# EasyEDA Pro project smart-switch-v101.eprj, board main-board
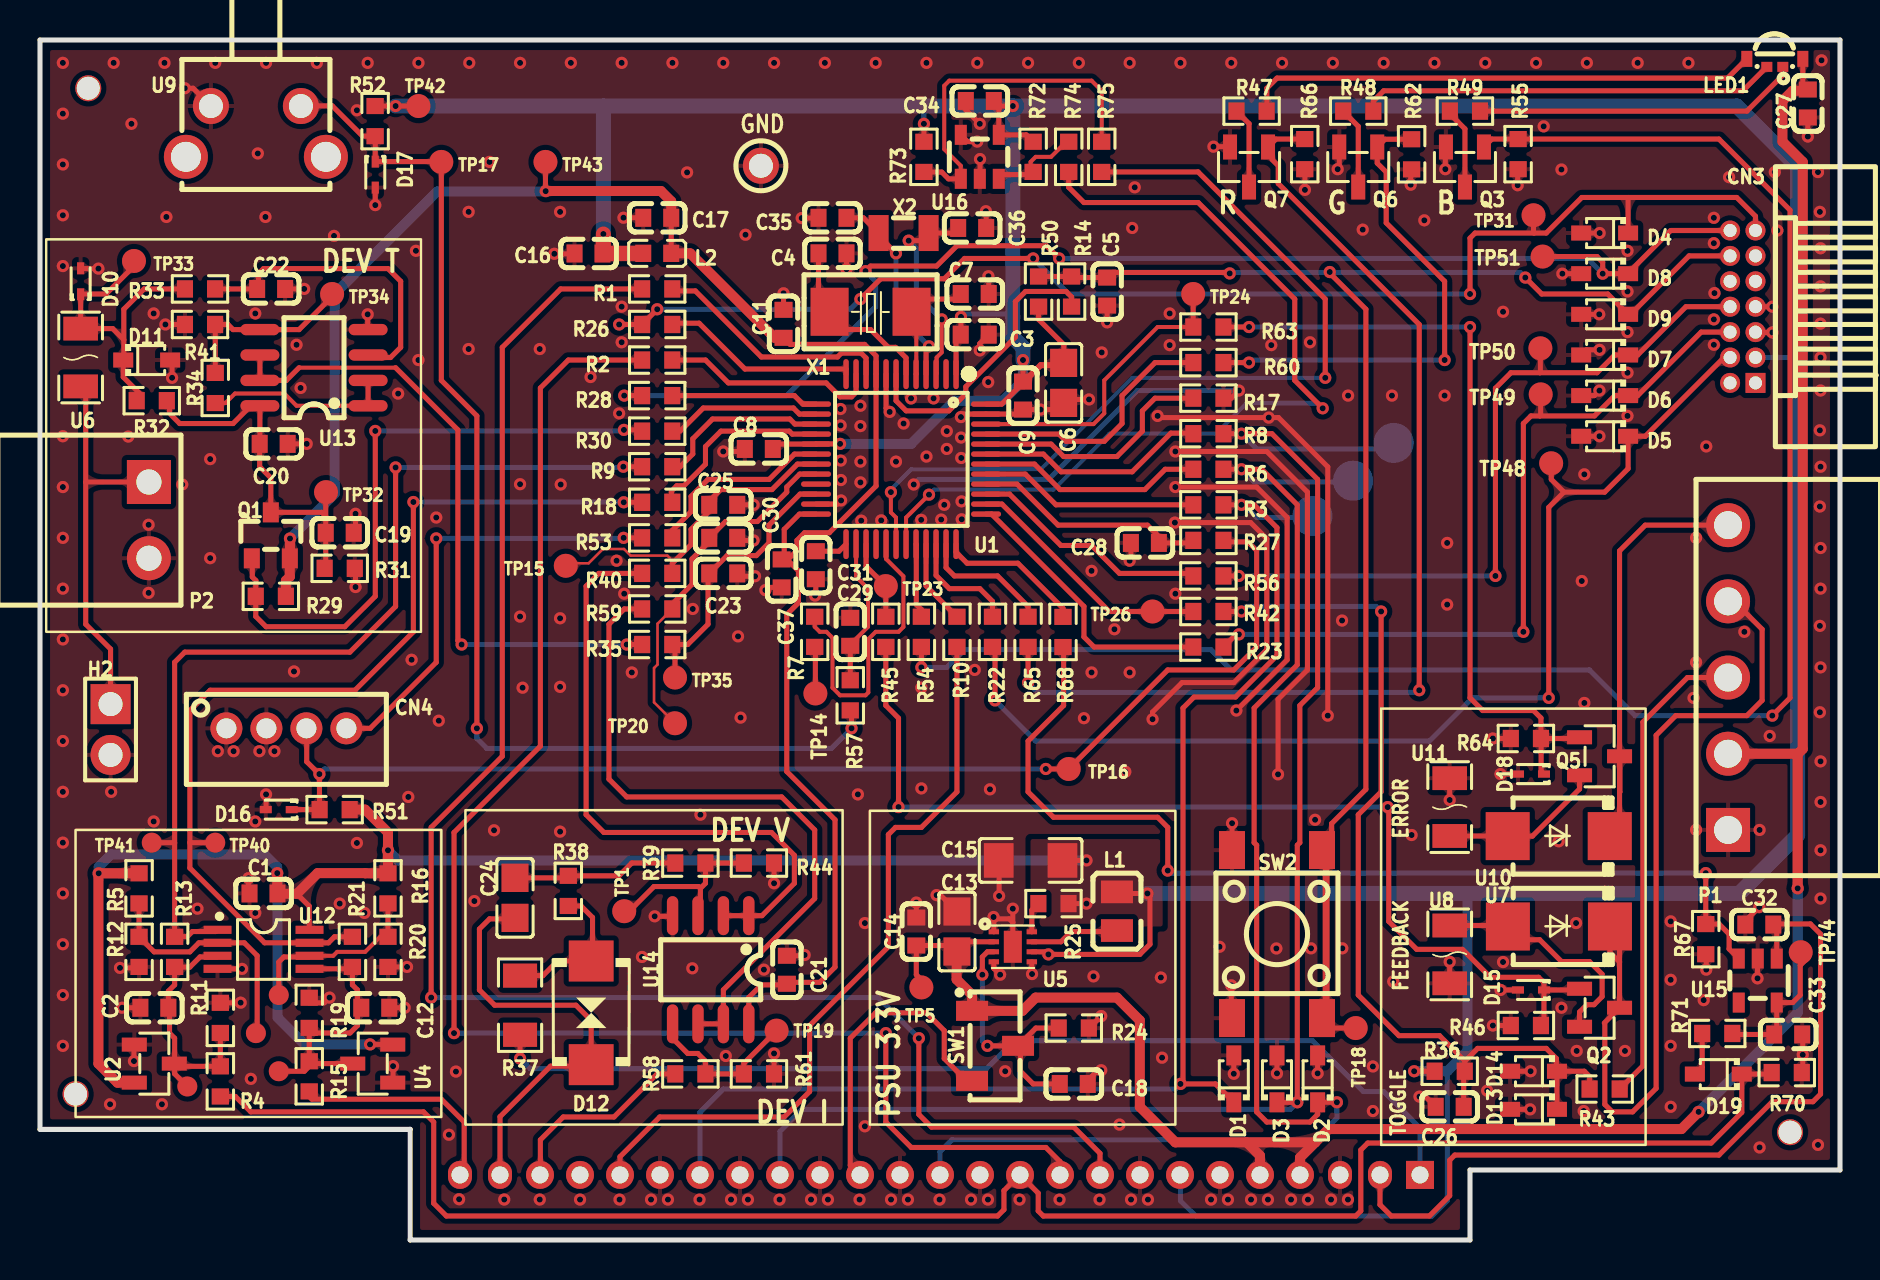
[diagram p3: board, top side]
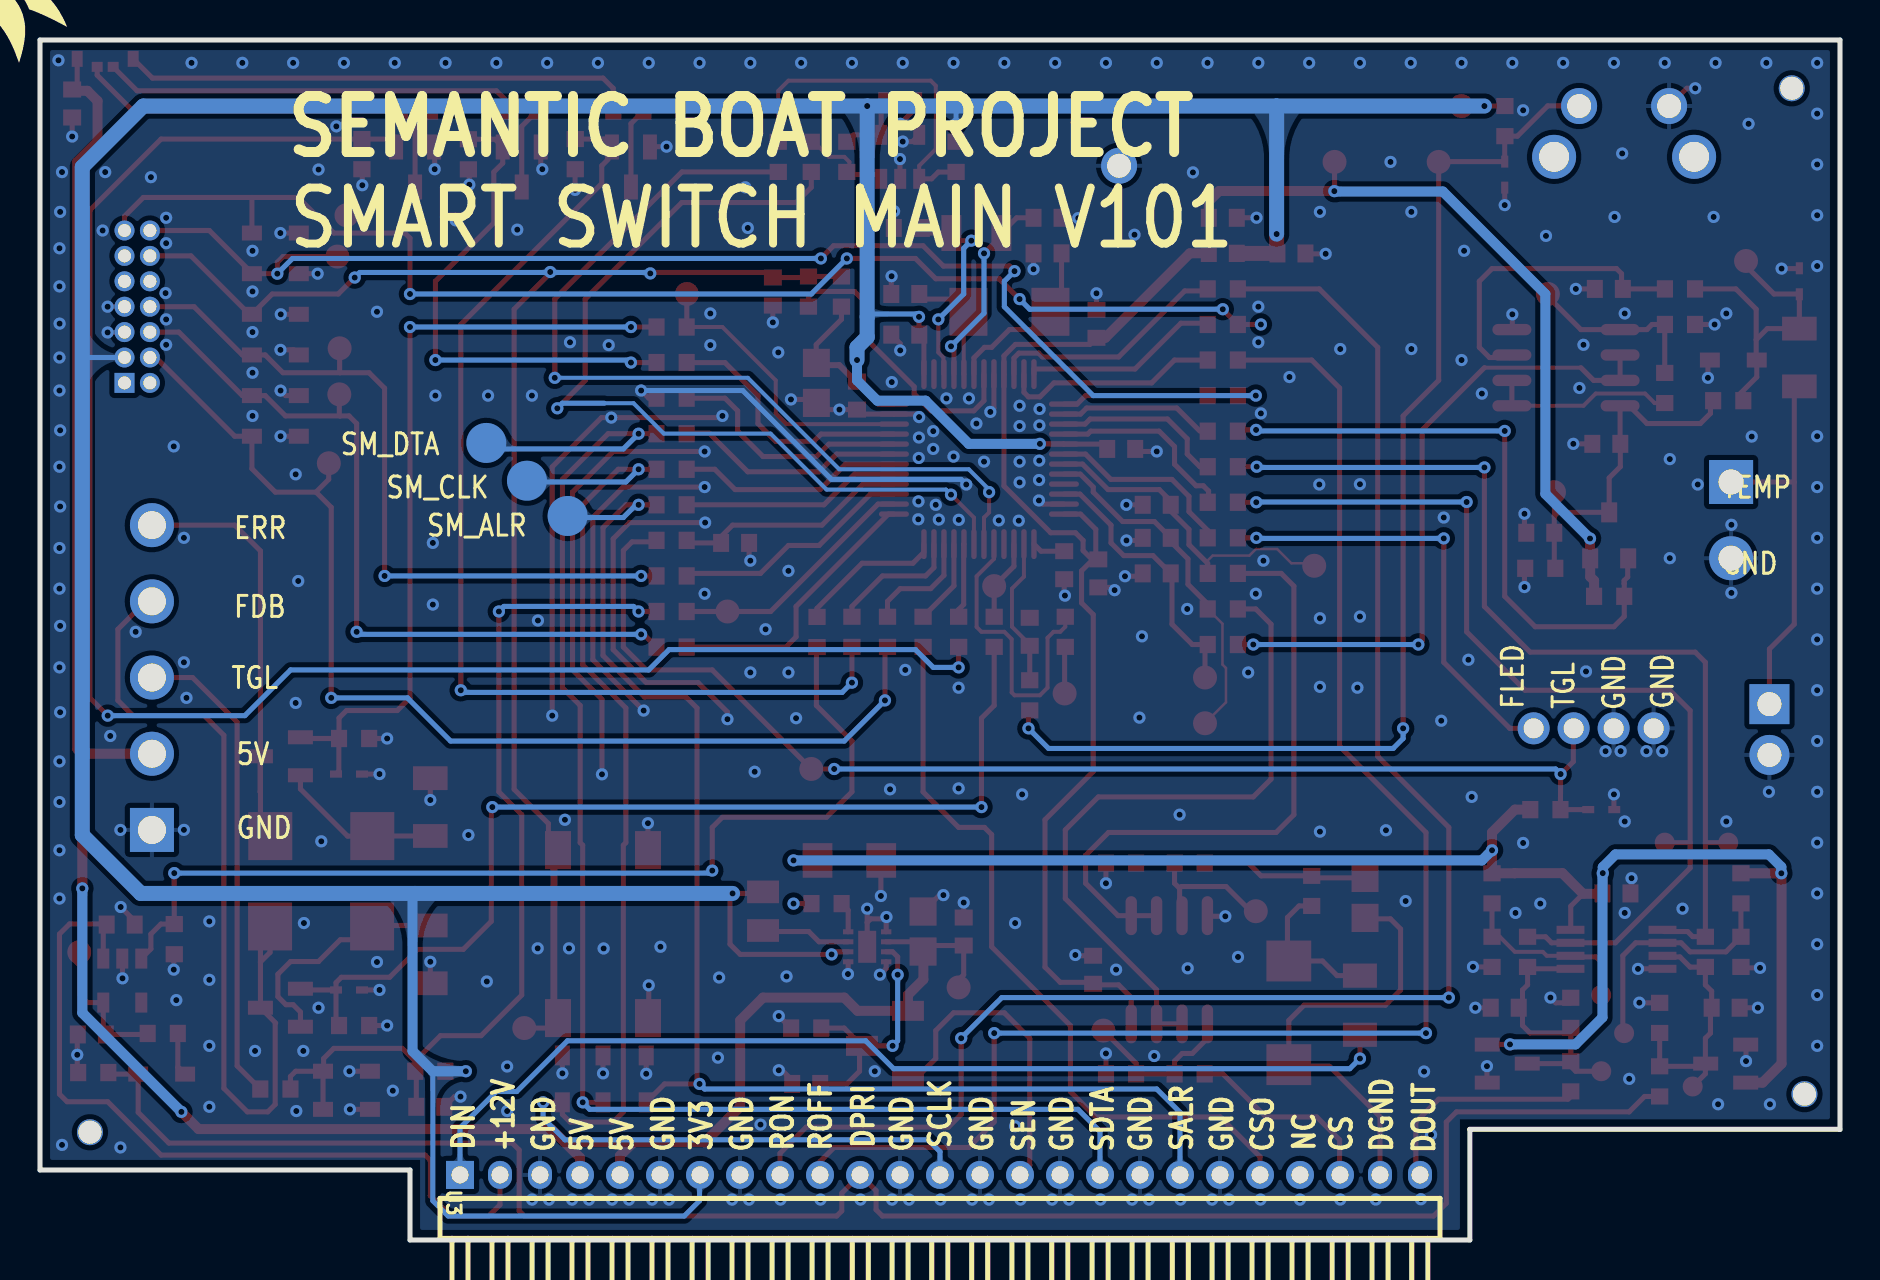
[diagram p4: board, bottom side, seen from below]

Outline 90 x 60 mm; copper layers: Top Layer, Inner1, Inner2, Bottom Layer. Coordinates in mm from the lower left corner of the outline.
Outline path: 0,60 90,60 90,3.5 71.5,3.5 71.5,0 18.51,0 18.51,5.53 0,5.53 0,60
Stack: Top Layer 0.035mm Outer layer thickness 1oz / Dielectric1 0.2104mm 7628 RC49% 8.6mil / Inner1 0.0152mm Inner layer thickness / Dielectric2 1.065mm 1.1mm H/HOZ Copper / Inner2 0.0152mm Inner layer thickness / Dielectric3 0.2104mm 7628 RC49% 8.6mil / Bottom Layer 0.035mm Outer layer thickness 1oz

## Design rules (mm)
template: JLCPCB Capability(Multiple Layers Board)
spacing copperThickness1oz (default): track to track 0.102, other pairs 0.152 to 0.3
spacing copperThickness2oz: track to track 0.203, other pairs 0.152 to 0.3
spacing copperThicknessInner0.5oz: track to track 0.089, other pairs 0.152 to 0.3
track width copperThickness1oz (default): min 0.102, default 0.254, max 2.54
track width copperThickness2oz: min 0.203, default 0.254, max 2.54
track width copperThickness0.5oz: min 0.089, default 0.254, max 2.54
differential pair differentialPair (default): width min 0.127, default 0.254, max 2.54; gap min 0.152, default 0.152
via viaSize (default): diameter min 0.3, default 0.61, max 10; hole min 0.2, default 0.305, max 6.3

## Placement (name value [footprint] x y rotation side)
C1  100nF  [C0603]  11.18 17.33 180 top
C2  2.2nF  [C0603]  5.72 11.61 0 top
C3  33pF  [C0603]  46.74 47.3 180 top
C4  33pF  [C0603]  39.62 49.33 180 top
C5  100nF  [C0603]  53.36 47.42 90 top
C6  4.7uF  [C0805]  51.18 42.86 90 top
C7  100nF  [C0603]  46.74 45.27 0 top
C8  100nF  [C0603]  35.94 39.55 180 top
C9  100nF  [C0603]  49.15 42.22 270 top
C11  100nF  [C0603]  37.18 45.81 90 top
C12  2.2nF  [C0603]  16.76 11.61 180 top
C13  10uF  [C0805]  45.85 15.42 90 top
C14  100nF  [C0603]  43.81 15.42 90 top
C15  22uF  [C1206]  49.53 18.98 180 top
C16  100nF  [C0603]  27.43 49.33 0 top
C17  100nF  [C0603]  30.86 51.11 0 top
C18  100nF  [C0603]  51.69 7.8 0 top
C19  100nF  [C0603]  14.99 35.36 0 top
C20  100nF  [C0603]  11.68 39.81 0 top
C21  100nF  [C0603]  37.34 13.51 90 top
C22  1nF  [C0603]  11.56 47.55 0 top
C23  100nF  [C0603]  34.16 33.33 0 top
C24  100nF  [C0805]  23.75 17.11 90 top
C25  22nF  [C0603]  34.16 36.76 180 top
C26  100nF  [C0603]  70.49 6.66 0 top
C27  100nF  [C0603]  88.39 56.83 270 top
C28  100nF  [C0603]  55.25 34.85 0 top
C29  100nF  [C0603]  40.51 30.41 270 top
C30  22nF  [C0603]  34.16 35.11 180 top
C31  100nF  [C0603]  38.79 33.74 90 top
C32  1uF  [C0603]  85.97 15.77 180 top
C33  10nF  [C0603]  87.41 10.28 180 top
C34  100nF  [C0603]  46.99 56.95 0 top
C35  22pF  [C0603]  39.62 51.11 0 top
C36  22pF  [C0603]  46.61 50.6 180 top
C37  100nF  [C0603]  37.08 33.33 270 top
CN3  HX PZ1.27-2x7P WZ  [HDR-TH_14P-P1.27-H-M-R2-C7-S1.27-W7.5-N]  85.14 46.67 90 top
CN4  B4B-PH-K-S(LF)(SN)  [CONN-TH_B4B-PH-K-S]  12.32 25.58 180 top
D1  PESD5V0U1UA,115  [SOD-323_L1.8-W1.3-LS2.5-RD]  59.69 8.06 90 top
D2  PESD5V0U1UA,115  [SOD-323_L1.8-W1.3-LS2.5-RD]  63.88 8.06 90 top
D3  PESD5V0U1UA,115  [SOD-323_L1.8-W1.3-LS2.5-RD]  61.85 8.06 90 top
D4  PESD5V0U1UA,115  [SOD-323_L1.8-W1.3-LS2.5-RD]  78.23 50.35 180 top
D5  PESD5V0U1UA,115  [SOD-323_L1.8-W1.3-LS2.5-RD]  78.23 40.19 180 top
D6  PESD5V0U1UA,115  [SOD-323_L1.8-W1.3-LS2.5-RD]  78.23 42.22 180 top
D7  PESD5V0U1UA,115  [SOD-323_L1.8-W1.3-LS2.5-RD]  78.23 44.25 180 top
D8  PESD5V0U1UA,115  [SOD-323_L1.8-W1.3-LS2.5-RD]  78.23 48.32 180 top
D9  PESD5V0U1UA,115  [SOD-323_L1.8-W1.3-LS2.5-RD]  78.23 46.28 180 top
D10  PESD3V3S1UB,115  [SOD-523_L1.2-W0.8-LS1.6-RD]  2.03 47.94 90 top
D11  BAT54WS-7-F  [SOD-323_L1.8-W1.3-LS2.5-RD]  5.33 44 0 top
D12  SMBJ28CA  [SMB_L4.6-W3.6-LS5.3-BI]  27.56 11.36 90 top
D13  PESD5V0U1UA,115  [SOD-323_L1.8-W1.3-LS2.5-RD]  74.68 6.53 180 top
D14  BAT54WS-7-F  [SOD-323_L1.8-W1.3-LS2.5-RD]  74.68 8.44 180 top
D15  PESD3V3S1UB,115  [SOD-523_L1.2-W0.8-LS1.6-RD]  74.55 12.5 180 top
D16  PESD3V3S1UB,115  [SOD-523_L1.2-W0.8-LS1.6-RD]  11.94 21.52 180 top
D17  PESD3V3S1UB,115  [SOD-523_L1.2-W0.8-LS1.6-RD]  16.76 53.27 270 top
D18  PESD3V3S1UB,115  [SOD-523_L1.2-W0.8-LS1.6-RD]  74.55 23.3 180 top
D19  1N5819WS  [SOD-323_L1.8-W1.3-LS2.5-RD]  83.92 8.29 180 top
H2  PZ254V-11-02P  [HDR-TH_2P-P2.54-V-M]  3.53 25.52 270 top
L1  2.2uH  [IND-SMD_L2.0-W1.6-1]  53.85 16.44 90 top
L2  BLM18KG601SN1D  [L0603]  30.86 49.33 0 top
LED1  MHS110RGBCT  [LED-ARRAY-SMD_MHS110RGBCT]  86.74 58.86 0 top
NOREF  -  [Pad_e184]  2.41 57.59 0 top
NOREF#2  -  [Pad_e3072]  87.5 5.39 0 top
NOREF#3  -  [Pad_e5111]  1.78 7.29 0 top
P1  WJ15EDGRC-3.81-5P  [CONN-TH_5P-P3.81_WJ15EDGRC-3.81-5P]  84.4 28.12 90 top
P2  WJ15EDGRC-3.81-2P  [CONN-TH_2P-P3.81_WJ15EDGRC-3.81-2P]  5.45 35.99 270 top
Q1  AO3401A  [SOT-23_L2.9-W1.3-P1.90-LS2.4-BR]  11.54 35.23 270 top
Q2  AO3400A  [SOT-23-3_L2.9-W1.3-P1.90-LS2.4-BR]  77.98 11.61 180 top
Q3  2N7002  [SOT-23-3_L2.9-W1.3-P1.90-LS2.4-BR]  71.25 53.65 90 top
Q5  AO3400A  [SOT-23-3_L2.9-W1.3-P1.90-LS2.4-BR]  77.98 24.19 180 top
Q6  2N7002  [SOT-23-3_L2.9-W1.3-P1.90-LS2.4-BR]  65.91 53.65 90 top
Q7  2N7002  [SOT-23-3_L2.9-W1.3-P1.90-LS2.4-BR]  60.45 53.65 90 top
R1  47Ω  [R0603]  30.86 47.55 0 top
R2  47Ω  [R0603]  30.86 44 0 top
R3  47Ω  [R0603]  58.42 36.76 180 top
R4  3.3MΩ  [R0603]  9.02 7.93 270 top
R5  1.8MΩ  [R0603]  4.95 17.58 90 top
R6  47Ω  [R0603]  58.42 38.54 180 top
R7  47Ω  [R0603]  38.74 30.41 90 top
R8  47Ω  [R0603]  58.42 40.31 180 top
R9  1kΩ  [R0603]  30.86 38.66 0 top
R10  47Ω  [R0603]  45.85 30.41 90 top
R11  430kΩ  [R0603]  9.02 11.1 270 top
R12  680kΩ  [R0603]  4.95 14.41 90 top
R13  10MΩ  [R0603]  6.73 14.41 270 top
R14  220Ω  [R0603]  51.58 47.42 270 top
R15  3.3MΩ  [R0603]  13.46 8.18 270 top
R16  1.8MΩ  [R0603]  17.4 17.58 90 top
R17  47kΩ  [R0603]  58.42 42.09 180 top
R18  1kΩ  [R0603]  30.86 36.89 0 top
R19  430kΩ  [R0603]  13.46 11.36 270 top
R20  680kΩ  [R0603]  17.4 14.41 90 top
R21  10MΩ  [R0603]  15.62 14.41 270 top
R22  47Ω  [R0603]  47.62 30.41 270 top
R23  47Ω  [R0603]  58.42 29.65 0 top
R24  100kΩ  [R0603]  51.69 10.6 0 top
R25  100kΩ  [R0603]  50.67 16.82 0 top
R26  100Ω  [R0603]  30.86 45.78 180 top
R27  100Ω  [R0603]  58.42 33.2 0 top
R28  100Ω  [R0603]  30.86 42.22 180 top
R29  100kΩ  [R0603]  11.54 32.18 0 top
R30  100Ω  [R0603]  30.86 40.44 180 top
R31  470kΩ  [R0603]  14.99 33.58 0 top
R32  10kΩ  [R0603]  5.59 41.97 0 top
R33  4.7kΩ  [R0603]  8 47.55 180 top
R34  220kΩ  [R0603]  8.76 42.6 270 top
R35  1kΩ  [R0603]  30.86 29.77 180 top
R36  100kΩ  [R0603]  70.49 8.44 180 top
R37  100Ω  [R1206]  24 11.74 90 top
R38  1kΩ  [R0603]  26.42 17.45 90 top
R39  270kΩ  [R0603]  32.52 18.85 0 top
R40  220Ω  [R0603]  30.86 33.33 180 top
R41  270kΩ  [R0603]  8 45.78 0 top
R42  4.7kΩ  [R0603]  58.42 31.42 180 top
R43  22kΩ  [R0603]  78.23 7.55 180 top
R44  30kΩ  [R0603]  35.95 18.85 180 top
R45  1kΩ  [R0603]  42.29 30.41 270 top
R46  100kΩ  [R0603]  74.29 10.72 180 top
R47  120Ω  [R0603]  60.58 56.44 0 top
R48  100Ω  [R0603]  65.91 56.44 0 top
R49  100Ω  [R0603]  71.25 56.44 0 top
R50  10kΩ  [R0603]  49.93 47.42 270 top
R51  10kΩ  [R0603]  14.73 21.52 0 top
R52  10kΩ  [R0603]  16.76 55.94 90 top
R53  820Ω  [R0603]  30.86 35.11 0 top
R54  100Ω  [R0603]  44.07 30.41 90 top
R55  100kΩ  [R0603]  73.91 54.29 270 top
R56  1kΩ  [R0603]  58.42 34.98 180 top
R57  1kΩ  [R0603]  40.51 27.23 90 top
R58  100kΩ  [R0603]  32.52 8.31 0 top
R59  220Ω  [R0603]  30.86 31.55 180 top
R60  100Ω  [R0603]  58.42 43.87 0 top
R61  56kΩ  [R0603]  35.95 8.31 180 top
R62  100kΩ  [R0603]  68.58 54.28 270 top
R63  1kΩ  [R0603]  58.42 45.65 0 top
R64  100kΩ  [R0603]  74.29 25.08 180 top
R65  100Ω  [R0603]  49.4 30.41 270 top
R66  100kΩ  [R0603]  63.24 54.29 270 top
R67  100kΩ  [R0603]  83.29 15.04 90 top
R68  47Ω  [R0603]  51.15 30.4 270 top
R70  470kΩ  [R0603]  87.34 8.37 180 top
R71  100kΩ  [R0603]  83.86 10.33 0 top
R72  3.3kΩ  [R0603]  49.66 54.16 90 top
R73  3.3kΩ  [R0603]  44.2 54.16 90 top
R74  47Ω  [R0603]  51.44 54.16 270 top
R75  47Ω  [R0603]  53.09 54.16 270 top
SW1  CAS-120A  [SW-SMD_CAS-120A]  47.75 9.71 270 top
SW2  TS-1002S-05026C  [KEY-SMD_4P-L6.0-W6.0-P4.50-LS9.0]  61.85 15.3 270 top
TP1  -  [Test-Point-0.5mm]  29.21 16.44 0 top
TP5  -  [Test-Point-0.5mm]  44.07 12.63 0 top
TP8  RH-5004  [TESTPOINT_TH_BD2.5-D1.2]  36.05 53.71 0 top
TP14  -  [Test-Point-0.5mm]  38.77 27.33 90 top
TP15  -  [Test-Point-0.5mm]  26.29 33.71 0 top
TP16  -  [Test-Point-0.5mm]  51.44 23.55 0 top
TP17  -  [Test-Point-0.5mm]  20.07 53.9 0 top
TP18  -  [Test-Point-0.5mm]  65.79 10.6 0 top
TP19  -  [Test-Point-0.5mm]  36.83 10.47 0 top
TP20  -  [Test-Point-0.5mm]  31.75 25.84 0 top
TP23  -  [Test-Point-0.5mm]  42.29 32.69 0 top
TP24  -  [Test-Point-0.5mm]  57.66 47.3 0 top
TP26  -  [Test-Point-0.5mm]  55.63 31.42 0 top
TP31  -  [Test-Point-0.5mm]  74.68 51.24 0 top
TP32  -  [Test-Point-0.5mm]  14.3 37.39 0 top
TP33  -  [Test-Point-0.5mm]  4.7 48.95 0 top
TP34  -  [Test-Point-0.5mm]  14.61 47.3 0 top
TP35  -  [Test-Point-0.5mm]  31.75 28.12 0 top
TP36  -  [Test-Point-0.5mm#2]  7.37 7.68 0 top
TP37  -  [Test-Point-0.5mm#2]  10.8 10.34 0 top
TP38  -  [Test-Point-0.5mm#2]  11.94 8.44 0 top
TP39  -  [Test-Point-0.5mm#2]  11.94 12.25 0 top
TP40  -  [Test-Point-0.5mm#2]  8.76 19.87 0 top
TP41  -  [Test-Point-0.5mm#2]  5.59 19.87 0 top
TP42  -  [Test-Point-0.5mm]  18.92 56.7 0 top
TP43  -  [Test-Point-0.5mm]  25.27 53.9 0 top
TP44  -  [Test-Point-0.5mm]  88.04 14.39 0 top
TP45  -  [Test-Point-0.5mm#3]  67.68 39.85 180 bottom
TP46  -  [Test-Point-0.5mm#3]  65.65 37.96 180 bottom
TP47  -  [Test-Point-0.5mm#3]  63.62 36.2 180 bottom
TP48  -  [Test-Point-0.5mm]  75.56 38.84 0 top
TP49  -  [Test-Point-0.5mm]  75.03 42.28 0 top
TP50  -  [Test-Point-0.5mm]  75.02 44.58 0 top
TP51  -  [Test-Point-0.5mm]  75.13 49.17 0 top
U1  STM32F373CCT6  [LQFP-48_L7.0-W7.0-P0.50-LS9.0-BL]  43.05 39.05 180 top
U2  BAV199  [SOT-23-3_L2.9-W1.3-P0.95-LS2.4-BR]  5.72 8.82 180 top
U3  KH-2PH90-1X25P-L10.5  [HDR-TH_25P-P2.00-H-M-W7.5-N]  45 3.25 180 bottom
U4  BAV199  [SOT-23-3_L2.9-W1.3-P0.95-LS2.4-BR]  16.64 8.82 0 top
U5  TPS62162DSGR  [WSON-8_L2.0-W2.0-P0.50-TL-EP]  48.64 14.66 0 top
U6  JK-nSMD005/60V  [F1206]  2.03 44.12 90 top
U7  SMBJ18A  [SMB_L4.5-W3.6-LS5.4-RD]  75.95 15.68 180 top
U8  JK-nSMD005/60V  [F1206]  70.49 14.28 90 top
U9  TC-6615-9.0-160G  [KEY-TH_PTS645VXX83XLFS]  10.8 55.43 180 top
U10  SMBJ18A  [SMB_L4.5-W3.6-LS5.4-RD]  75.94 20.19 180 top
U11  JK-nSMD005/60V  [F1206]  70.49 21.65 270 top
U12  RS8905XM  [MSOP-8_L3.0-W3.0-P0.65-LS4.9-BL]  11.18 14.53 270 top
U13  TLV9062IDR  [SOIC-8_L5.0-W4.0-P1.27-LS6.0-BL]  13.7 43.61 90 top
U14  TLV9062IDR  [SOIC-8_L5.0-W4.0-P1.27-LS6.0-BL]  33.53 13.51 180 top
U15  TMI6240  [SOT-23-5_L2.9-W1.6-P0.95-LS2.8-BL]  85.89 12.97 180 top
U16  AD24C02  [SOT-23-5_L2.9-W1.6-P0.95-LS2.8-BL]  46.99 54.16 0 top
X1  8MHz  [CRYSTAL-SMD_L5.0-W3.2]  41.53 46.41 0 top
X2  32.768kHz  [FC-135R_L3.2-W1.5]  43.18 50.35 0 top

## Footprints (pads in the part's own frame, mm; a bottom-side part is the same pattern mirrored in y, then rotated)
C0603
  rect 0.8x0.9 smd: 1(-0.7,0) 2(0.7,0)
C0805
  rect 1.41x1.35 smd: 1(-1,0) 2(1,0)
C1206
  rect 1.485x1.728 smd: 1(-1.593,0) 2(1.593,0)
CONN-TH_2P-P3.81_WJ15EDGRC-3.81-2P
  rect 2.2x2.2 hole 1.26: 1(-1.905,0)
  round 2.2 hole 1.26: 2(1.905,0)
CONN-TH_5P-P3.81_WJ15EDGRC-3.81-5P
  rect 2.2x2.2 hole 1.4: 1(-7.62,0)
  round 2.2 hole 1.4: 2(-3.81,0) 3(0,0) 4(3.81,0) 5(7.62,0)
CONN-TH_B4B-PH-K-S
  round 1.6 hole 1: 1(3,0) 2(1,0) 3(-1,0) 4(-3,0)
CRYSTAL-SMD_L5.0-W3.2
  rect 1.9x2.4 smd: 1(-2.05,0) 2(2.05,0)
F1206
  rect 1.19x1.728 smd: 1(-1.445,0) 2(1.445,0)
FC-135R_L3.2-W1.5
  rect 1x1.8 smd: 1(-1.25,0) 2(1.25,0)
HDR-TH_2P-P2.54-V-M
  rect 2x2 hole 1.2: 1(-1.27,0)
  round 2 hole 1.2: 2(1.27,0)
HDR-TH_14P-P1.27-H-M-R2-C7-S1.27-W7.5-N
  rect 1x1 hole 0.65: 1(-3.81,-0.635)
  round 1 hole 0.65: 2(-3.81,0.635) 3(-2.54,-0.635) 4(-2.54,0.635) 5(-1.27,-0.635) 6(-1.27,0.635) 7(0,-0.635) 8(0,0.635) 9(1.27,-0.635) 10(1.27,0.635) 11(2.54,-0.635) 12(2.54,0.635) 13(3.81,-0.635) 14(3.81,0.635)
HDR-TH_25P-P2.00-H-M-W7.5-N
  rect 1.4x1.4 hole 0.85: 1(-24,0)
  oval 1.2x1.4 hole 0.85: 2(-22,0) 3(-20,0) 24(22,0) 25(24,0)
  round 1.4 hole 0.85: 4(-18,0) 5(-16,0) 6(-14,0) 7(-12,0) 8(-10,0) 9(-8,0) 10(-6,0) 11(-4,0) 12(-2,0) 13(0,0) 14(2,0) 15(4,0) 16(6,0) 17(8,0) 18(10,0) 19(12,0) 20(14,0) 21(16,0) 22(18,0) 23(20,0)
IND-SMD_L2.0-W1.6-1
  rect 1.133x1.6 smd: 1(-0.967,0) 2(0.967,0)
KEY-SMD_4P-L6.0-W6.0-P4.50-LS9.0
  rect 1.9x1.3 smd: 1(-4.2,2.25) 2(4.2,2.25) 3(-4.2,-2.25) 4(4.2,-2.25)
KEY-TH_PTS645VXX83XLFS
  round 1.8 hole 1.2: 1(-2.25,-1.27) 2(2.25,-1.27)
  round 2.2 hole 1.5: 3(-3.5,1.27) 4(3.5,1.27)
L0603
  rect 0.8x0.864 smd: 1(-0.7,0) 2(0.7,0)
LED-ARRAY-SMD_MHS110RGBCT
  rect 0.55x0.5 smd: 1(0.4,-0.2) 4(-0.4,-0.2)
  rect 0.55x0.8 smd: 2(1.4,0.2) 3(-1.4,0.2)
LQFP-48_L7.0-W7.0-P0.50-LS9.0-BL
  oval 0.27x1.5 smd: 1(-2.75,-4.25) 2(-2.25,-4.25) 3(-1.75,-4.25) 4(-1.25,-4.25) 5(-0.75,-4.25) 6(-0.25,-4.25) 7(0.25,-4.25) 8(0.75,-4.25) 9(1.25,-4.25) 10(1.75,-4.25) 11(2.25,-4.25) 12(2.75,-4.25) 25(2.75,4.25) 26(2.25,4.25) 27(1.75,4.25) 28(1.25,4.25) 29(0.75,4.25) 30(0.25,4.25) 31(-0.25,4.25) 32(-0.75,4.25) 33(-1.25,4.25) 34(-1.75,4.25) 35(-2.25,4.25) 36(-2.75,4.25)
  oval 1.5x0.27 smd: 13(4.25,-2.75) 14(4.25,-2.25) 15(4.25,-1.75) 16(4.25,-1.25) 17(4.25,-0.75) 18(4.25,-0.25) 19(4.25,0.25) 20(4.25,0.75) 21(4.25,1.25) 22(4.25,1.75) 23(4.25,2.25) 24(4.25,2.75) 37(-4.25,2.75) 38(-4.25,2.25) 39(-4.25,1.75) 40(-4.25,1.25) 41(-4.25,0.75) 42(-4.25,0.25) 43(-4.25,-0.25) 44(-4.25,-0.75) 45(-4.25,-1.25) 46(-4.25,-1.75) 47(-4.25,-2.25) 48(-4.25,-2.75)
MSOP-8_L3.0-W3.0-P0.65-LS4.9-BL
  rect 0.406x1.397 smd: 1(-0.975,-2.3) 2(-0.325,-2.3) 3(0.325,-2.3) 4(0.975,-2.3) 5(0.975,2.3) 6(0.325,2.3) 7(-0.325,2.3) 8(-0.975,2.3)
Pad_e184
  round 1.3 hole 1.152: 1(0,0)
Pad_e3072
  round 1.3 hole 1.152: 1(0,0)
Pad_e5111
  round 1.3 hole 1.152: 1(0,0)
R0603
  rect 0.806x0.864 smd: 1(-0.753,0) 2(0.753,0)
R1206
  rect 1.208x1.701 smd: 1(-1.479,0) 2(1.479,0)
SMB_L4.5-W3.6-LS5.4-RD
  rect 2.2x2.4 smd: 1(-2.551,0) 2(2.551,0)
SMB_L4.6-W3.6-LS5.3-BI
  rect 2.047x2.241 smd: 1(-2.591,0) 2(2.591,0)
SOD-323_L1.8-W1.3-LS2.5-RD
  rect 1x0.75 smd: 1(-1.173,0) 2(1.173,0)
SOD-523_L1.2-W0.8-LS1.6-RD
  rect 0.6x0.36 smd: 1(-0.65,0) 2(0.65,0)
SOIC-8_L5.0-W4.0-P1.27-LS6.0-BL
  oval 0.569x1.95 smd: 1(-1.905,-2.705) 2(-0.635,-2.705) 3(0.635,-2.705) 4(1.905,-2.705) 5(1.905,2.705) 6(0.635,2.705) 7(-0.635,2.705) 8(-1.905,2.705)
SOT-23-3_L2.9-W1.3-P0.95-LS2.4-BR
  rect 1.25x0.7 smd: 1(1,-0.95) 2(1,0.95) 3(-1,0)
SOT-23-3_L2.9-W1.3-P1.90-LS2.4-BR
  rect 1.25x0.7 smd: 1(1,-0.95) 2(1,0.95) 3(-1,0)
SOT-23-5_L2.9-W1.6-P0.95-LS2.8-BL
  rect 0.6x1 smd: 1(-0.95,-1.1) 2(0,-1.1) 3(0.95,-1.1) 4(0.95,1.1) 5(-0.95,1.1)
SOT-23_L2.9-W1.3-P1.90-LS2.4-BR
  rect 1x0.8 smd: 1(1.15,-0.95) 2(1.15,0.95) 3(-1.15,0)
SW-SMD_CAS-120A
  rect 1x1.6 smd: 1(-1.75,-1.15) 2(0,1.15) 3(1.75,-1.15)
Test-Point-0.5mm
  round 1.2 smd: 1(0,0)
Test-Point-0.5mm#2
  round 1 smd: 1(0,0)
Test-Point-0.5mm#3
  round 2 smd: 1(0,0)
TESTPOINT_TH_BD2.5-D1.2
  round 1.8 hole 1.2: 1(0,0)
WSON-8_L2.0-W2.0-P0.50-TL-EP
  rect 0.521x0.25 smd: 1(-0.95,0.75) 2(-0.95,0.25) 3(-0.95,-0.25) 4(-0.95,-0.75) 5(0.95,-0.75) 6(0.95,-0.25) 7(0.95,0.25) 8(0.95,0.75)
  rect 0.9x1.6 smd: 9(0,0)

## Nets
As in the schematic.

Pads without a net: CN3 1 2 9 10 11; NOREF 1; NOREF#2 1; NOREF#3 1; U1 2 21 28; U3 22; U9 3 4; U15 4

## Via types
v1: diameter 0.61, hole 0.305, Top Layer to Bottom Layer, 473 vias

## Routing (per net, layer and track width the routed paths; a pad name or vN(x,y) marks a point on that pad's centre or on a via; arc(x,y) is an arc through that point)
+3V3: length 332
  Top Layer w0.254: 49.15,42.86 48.09,41.8 U1.48 ; 36.9,39.81 36.91,39.8 U1.17 38.81,39.81 v1(40,39.81) ; R50.2 49.93,46.03 51.19,44.77 51.19,43.86 ; 47.94,56.7 U16.4 49.31,55.26 R72.2 ; 47.94,56.7 47.94,56.7 v1(48.64,56.7) ; 47.94,56.7 C34.2 ; v1(46.05,46.16) 46.05,45.28 C7.1 ; U4.2 17.63,9.78 v1(16.5,9.78) ; R52.2 v1(17.78,56.7) TP42.1 ; 49.59,14.41 50.29,14.41 v1(50.42,14.28) 54.99,14.28 55.5,14.79 55.5,17.2 v1(55.37,17.33) 53.93,17.33 L1.2 ; 12.85,17.31 13.46,16.69 13.46,15.52 U12.8 ; U1.1 45.8,45.03 ; C9.1 v1(49.15,44) ; C15.1 v1(52.32,18.98) ; v1(52.32,16.82) 51.43,16.82 ; R73.2 v1(44.2,55.81) ; v1(68.71,8.44) R36.2
  Top Layer w0.3: 49.21,42.92 50.04,43.74 51.07,43.74 C6.2
  Top Layer w0.5: v1(11.86,18.34) 11.86,17.38 11.81,17.33 ; v1(2.93,18.34) 2.92,18.32 2.92,8.82 3.87,7.87 4.71,7.87 U2.2 ; R51.2 16.26,21.52 17.4,20.38 v1(17.4,19.49) R16.2 16.26,18.34 16.26,18.34 13.88,18.34 12.85,17.31 12.11,17.31
  Top Layer w0.508: v1(2.93,18.34) R5.2
  Top Layer w0.75: L2.1 30.16,49.33 C16.2 28.17,49.37 v1(28.17,50.3)
  Bottom Layer w0.25: 70.36,8.43 70.36,1.96 69.6,1.2 57.78,1.2 57.02,1.96 57.02,3.23 U3.7
  Bottom Layer w0.254: v1(46.05,46.16) 46.19,46.3 48.5,46.3 48.64,46.16 ; 85.78,44.12 87.76,44.12 ; v1(44.2,55.81) 44.2,56.69 44.19,56.7
  Bottom Layer w0.5: v1(52.32,18.98) 17.91,18.98 v1(17.4,19.49) ; 71.25,17.33 71.37,17.2 71.37,9.45 70.37,8.44 ; v1(40,39.81) 43.56,39.81 45.72,41.97 48.13,41.97 49.15,42.98 v1(49.15,44) ; v1(2.93,18.34) 2.93,18.66 3.56,19.28 11.23,19.28 11.86,18.64 v1(11.86,18.34) 11.88,18.33 11.88,11.13 13.22,9.78 v1(16.5,9.78)
  Bottom Layer w0.508: 70.37,8.44 v1(68.71,8.44)
  Bottom Layer w0.75: v1(55.37,17.33) 84.96,17.33 87.88,20.25 87.88,53.65 84.84,56.7 v1(48.64,56.7) ; 28.18,56.7 28.17,56.69 v1(28.17,50.3) ; 28.18,56.7 v1(17.78,56.7) ; 28.18,56.7 v1(48.64,56.7) ; v1(48.64,56.7) 48.64,45.14 49.15,44.63 v1(49.15,44)
+5V: length 115.9
  Top Layer w0.254: TP5.1 44.07,13.01 43.81,13.26 C14.1 45.55,14.72 C13.1 46.34,14.91 U5.2 ; C27.1 88.14,57.78 88.14,59.06
  Top Layer w0.5: 60.33,4.88 61,4.22 U3.5 ; 60.33,4.88 56.77,4.88 54.99,6.66 54.99,10.98 53.85,12.12 49.78,12.12 49.12,11.46 SW1.1 46.6,12.25 45.83,13.03 45.83,14.41 C13.1 ; 60.33,4.88 63.76,4.88 ; 63.76,4.88 63,4.12 U3.4 ; 63.76,4.88 64.43,5.55 82.07,5.55 v1(82.93,6.41) ; 88.29,57.46 87.63,57.46 87.12,56.95 87.12,54.92 88.14,53.9 88.14,24.55 87.88,24.3
  Top Layer w0.508: v1(87.88,17.58) 87.88,24.3 87.87,24.31 P1.2
  Bottom Layer w0.508: v1(87.88,17.58) 87.88,11.36 v1(82.93,6.41)
+12V: length 39.7
  Top Layer w0.254: U15.1 86.84,15.6 C32.1 86.7,15.8 88.52,15.8 89.03,15.3 89.03,7.29 88.65,6.91 86.61,6.91 83.95,4.25 70.74,4.25 70.49,3.99 70.49,2.22 69.47,1.2 67.56,1.2 67,1.76 U3.2
GND: length 194.6
  Top Layer w0.254: U13.4 16.38,45.54 v1(16.38,46.28) ; 13.46,11.86 14.22,11.86 v1(14.48,12.12) ; R44.1 36.7,18.84 v1(36.7,17.84) ; v1(42.48,41.41) 42.3,41.59 U1.8 ; R31.2 15.78,33.55 v1(15.78,32.65) ; v1(59.82,26.47) 62.36,29.01 62.36,36.12 60.83,37.65 v1(56.77,37.65) ; C36.1 47.31,51.43 v1(47.29,51.44) ; 69.78,6.66 69.28,7.17 v1(68.97,7.17) ; U15.2 85.88,14.06 v1(85.88,13.08) ; v1(85.97,16.65) 85.27,15.95 C32.2 ; C4.1 v1(40.32,48.54) ; v1(53.06,8.49) 52.89,8.49 52.43,8.02 52.64,7.8 ; v1(61.85,8.33) D3.2 ; 34.86,34.98 34.87,34.98 v1(35.68,34.98) ; v1(38.75,32.22) 38.79,32.26 C31.1 ; 54.54,34.85 54.54,34.03 v1(54.48,33.97) ; v1(70.27,53.54) 70.27,54.62 70.3,54.65 ; v1(16.76,51.75) D17.2 ; R61.1 36.7,8.31 v1(36.7,9.33) ; C3.1 47.44,48.17 v1(47.42,48.19) ; v1(77.98,50.35) D4.2 ; v1(59.94,42.47) 59.56,42.09 R17.1 ; v1(30.73,16.19) 31.6,16.19 U14.4 ; v1(56.74,35.87) 60.53,35.87 61.34,35.06 61.34,29.52 59.69,27.87 57.1,27.87 55.63,26.4 v1(55.63,26.04) ; 17.34,11.61 v1(18.23,11.61) ; v1(77.97,42.47) 77.72,42.22 D6.2 ; v1(83.31,13.52) 83.31,14.26 83.29,14.29 ; C20.2 v1(13.33,39.81) ; 47.69,16.01 47.74,16.06 48.46,16.06 48.64,15.88 ; 47.69,16.01 47.69,16.14 v1(47.68,16.15) ; 47.69,16.01 U5.1 ; Q7.2 59.49,54.67 v1(58.67,54.67) ; v1(48.01,13.26) 47.69,13.58 U5.4 ; v1(68.53,52.76) 68.53,53.49 R62.2 ; R20.1 18.35,13.65 v1(18.35,13.66) ; D11.2 6.6,43.9 v1(6.6,43.11) ; v1(86.62,45.38) 85.79,45.38 85.78,45.39 ; v1(15.78,36.31) 15.78,35.45 C19.2 ; v1(49.6,13.3) 49.59,13.31 49.59,13.91 ; v1(59.6,20.84) 59.6,19.63 59.6,19.62 ; U9.2 7.66,57.59 v1(7.24,57.59) ; v1(10.42,18.09) 10.42,17.25 10.48,17.2 ; v1(61.9,23.28) 61.9,27.03 63.37,28.5 63.37,37.39 61.34,39.43 v1(56.77,39.43) ; v1(4,13.61) 4.91,13.61 R12.1 ; R41.1 v1(6.27,45.78) ; v1(88.39,55.17) 88.39,55.87 88.65,56.12 ; 34.86,33.2 34.88,33.19 v1(35.75,33.19) ; C21.2 38.19,14.21 v1(38.23,14.25) ; C17.1 29.82,51.11 29.82,51.11 v1(29.18,51.11) ; v1(4.7,8.95) 4.7,9.75 U2.1 ; v1(63.88,8.33) D2.2 ; v1(11.3,22.28) 11.3,21.53 D16.2 ; v1(43.81,16.87) C14.2 ; v1(76.12,48.32) D8.2 ; C13.2 45.03,17.25 v1(44.83,17.25) ; v1(34.16,39.43) 35.11,39.43 C8.2 35.5,39.81 ; v1(47.96,17.2) 47.96,18.96 C15.2 ; v1(63.25,52.51) 63.25,53.53 R66.2 ; v1(52.45,42.03) 51.35,42.03 C6.1 50.85,41.52 v1(50.03,41.52) C9.2 48.92,41.3 U1.47 46.2,41.3 v1(46.05,41.15) ; v1(72.64,25.08) R64.2 ; 48.64,15.88 v1(48.64,16.57) ; 48.64,15.88 U5.9 ; v1(10.03,11.87) 10.02,11.86 R11.1 ; v1(10.1,13.56) 10.1,13.56 U12.4 ; 26.74,49.31 25.72,49.31 v1(25.72,49.31) ; v1(73.03,23.3) D18.2 ; v1(86.62,46.67) 85.78,46.67 ; v1(46.99,44.48) 46.99,44.82 C7.2 ; v1(47,54.05) 47,53.07 U16.2 ; v1(73.03,12.5) D15.2 ; v1(46.99,55.81) 46.29,56.51 C34.1 ; U4.1 17.65,7.88 v1(17.65,8.69) ; Q6.2 64.96,53.62 v1(64.88,53.54) ; v1(72.64,10.72) R46.2 ; 2.03,48.58 2.05,48.57 v1(2.92,48.57) ; 59.6,11.22 59.56,11.26 v1(59.56,12.73) ; 52.7,10.6 52.7,10.83 v1(53.06,11.2) ; v1(55.88,41.2) 55.96,41.12 v1(61.44,41.12) 61.93,41.12 64.39,38.66 v1(64.39,26.22) ; C35.1 38.91,51.1 v1(38.09,51.1) ; v1(77.98,44.51) 77.31,44.51 D7.2 ; v1(13.21,47.55) C22.2 ; C5.1 v1(53.36,45.88) ; v1(70.49,13.91) U8.1 ; v1(77.96,46.28) D9.2 ; v1(74.53,8.44) D14.2 ; v1(77.97,40.19) D5.2 ; C37.2 36.41,32.63 v1(36.27,32.49) ; C33.1 88.14,10.25 v1(88.14,9.26) 88.14,8.42 R70.1 ; R55.2 73.88,53.52 v1(73.88,52.74) ; U16.5 46.38,54.92 v1(46.86,54.92) ; C2.1 v1(4.11,11.61) ; v1(59.69,8.31) D1.2 ; U1.23 39.87,36.8 v1(40.05,36.98) ; C25.1 v1(35.68,36.76) ; v1(37.18,47.33) C11.2 ; v1(70.49,22) U11.1 ; v1(74.5,6.53) D13.2
  Bottom Layer w0.254: v1(43.69,37.78) 43.94,38.03 50.42,38.03 54.86,42.47 v1(59.94,42.47)
  vias: v1(1.14,58.86) v1(1.14,56.32) v1(1.14,53.78) v1(1.14,51.24) v1(1.14,48.7) v1(1.14,40.19) v1(1.14,37.65) v1(1.14,35.11) v1(1.14,32.57) v1(1.14,30.03) v1(1.14,27.49) v1(1.14,24.95) v1(1.14,22.41) v1(1.14,19.87) v1(1.14,17.33) v1(1.14,14.79) v1(1.14,12.25) v1(1.14,9.71) v1(3.5,6.79) v1(3.56,22.41) v1(3.68,58.86) v1(4.41,40.17) v1(4.57,55.81) v1(5.43,35.76) v1(5.43,32.36) v1(5.68,46.33) v1(5.68,20.93) v1(6.1,6.79) v1(6.22,58.86) v1(6.32,51.15) v1(7.11,37.78) v1(7.87,16.57) v1(8.51,39.05) v1(8.51,34.09) v1(8.76,58.86) v1(8.89,24.44) v1(9.68,24.44) v1(10.54,8.06) v1(10.76,46.33) v1(10.76,20.93) v1(10.76,16.35) v1(10.89,54.33) v1(10.97,24.44) v1(11.3,58.86) v1(11.27,51.15) v1(11.72,24.44) v1(12.7,28.43) v1(12.83,44.76) v1(13.03,42.6) v1(13.84,58.86) v1(14.7,50.2) v1(14.99,16.82) v1(15.84,56.49) v1(15.84,19.85) v1(16.22,16.35) v1(16.38,58.86) v1(17.91,42.32) v1(18.42,22.15) v1(18.58,29.01) v1(18.8,49.46) v1(18.92,58.86) v1(18.92,44) v1(19.81,36.12) v1(19.94,25.96) v1(20.45,5.26) v1(20.8,8.42) v1(20.95,2.04) v1(21.43,51.41) v1(21.43,44.55) v1(21.46,58.86) v1(21.72,16.95) v1(22.48,53.9) v1(22.7,20.49) v1(23.21,2.02) v1(24,58.86) v1(24,37.79) v1(24,31.17) v1(24.13,27.61) v1(24.99,44.55) v1(24.99,2.02) v1(26,51.41) v1(26.03,37.78) v1(26,31.09) v1(26,27.66) v1(26,20.42) v1(26.54,58.86) v1(27,2.02) v1(27.53,43.15) v1(28.83,33.97) v1(28.96,41.33) v1(28.98,2.02) v1(29.08,58.86) v1(29.08,46.67) v1(29.08,44.89) v1(29.21,32.31) v1(29.59,28.38) v1(30.1,14.15) v1(30.55,2.02) v1(31.4,2.02) v1(31.62,58.86) v1(32.35,53.38) v1(32.64,31.55) v1(32.62,13.58) v1(33.02,21.27) v1(32.98,2.02) v1(34.16,58.86) v1(34.29,9.2) v1(34.55,2.02) v1(34.9,30.18) v1(35.03,26.12) v1(35.28,50.26) v1(35.4,2.02) v1(36.19,13.52) v1(36.7,58.86) v1(36.98,2.02) v1(38.55,2.02) v1(39.24,58.86) v1(39.4,2.02) v1(40.02,41.55) v1(40.03,40.73) v1(40.04,38.97) v1(40.05,38) v1(40.89,22.28) v1(41.02,41.71) v1(41.02,40.7) v1(41.02,38.92) v1(41.02,37.88) v1(40.98,2.02) v1(41.06,35.97) v1(41.24,15.85) v1(41.24,5.69) v1(41.78,58.86) v1(42.06,35.98) v1(42.55,2.02) v1(42.8,38.92) v1(43.18,40.82) v1(43.4,2.02) v1(43.55,42.08) v1(44.06,36.01) v1(44.07,27.61) v1(44.07,22.58) v1(44.32,58.86) v1(44.32,39.17) v1(44.68,42.08) v1(44.98,2.02) v1(45.06,36.02) v1(45.21,36.76) v1(45.34,40.44) v1(45.34,39.55) v1(46.05,40.12) v1(46.06,39.1) v1(46.08,36.93) v1(46.09,36.04) v1(46.55,2.02) v1(46.74,28.5) v1(46.86,58.86) v1(47.41,42.89) v1(47.4,2.02) v1(47.5,22.53) v1(48.26,8.44) v1(48.98,2.02) v1(49.4,58.86) v1(50.98,2.02) v1(51.94,58.86) v1(52.2,26.09) v1(52.58,33.46) v1(52.58,28.38) v1(52.67,13.18) v1(52.98,2.02) v1(53.09,44.38) v1(53.72,30.54) v1(53.97,5.77) v1(54.27,23.41) v1(54.48,58.86) v1(54.48,28.38) v1(54.61,50.6) v1(54.55,2.02) v1(54.74,52.63) v1(55.4,2.02) v1(56.04,13.12) v1(56.1,9.12) v1(56.48,46.33) v1(56.48,44.74) v1(56.77,32.31) v1(57.02,58.86) v1(58.55,2.02) v1(58.98,14.66) v1(59.4,2.02) v1(59.56,58.86) v1(60.55,2.02) v1(61.4,2.02) v1(61.56,44.74) v1(61.82,14.58) v1(62.1,58.86) v1(62.55,2.02) v1(63.4,2.02) v1(63.5,44.89) v1(63.55,14.58) v1(63.75,21.01) v1(64.64,58.86) v1(64.55,2.02) v1(65.1,30.97) v1(65.12,14.58) v1(65.41,42.22) v1(65.4,2.02) v1(66.14,50.52) v1(66.64,8.68) v1(66.64,6.45) v1(67.18,58.86) v1(67.6,42.22) v1(67.66,12.93) v1(68.58,20.25) v1(69.22,50.98) v1(69.72,58.86) v1(70.23,42.22) v1(70.36,34.85) v1(70.36,31.77) v1(72.26,58.86) v1(72.36,7.46) v1(73.15,46.41) v1(73.15,13.9) v1(74.8,58.86) v1(75.18,55.68) v1(75.94,19.93) v1(76.07,53.52) v1(76.07,11.61) v1(76.8,15.85) v1(76.84,9.45) v1(77.09,32.95) v1(77.22,38.28) v1(77.22,26.85) v1(77.19,6.45) v1(77.34,58.86) v1(79.25,9.45) v1(79.38,49.46) v1(79.38,47.43) v1(79.38,45.39) v1(79.38,43.36) v1(79.38,41.2) v1(79.88,58.86) v1(81.53,15.93) v1(81.53,13.01) v1(81.53,9.71) v1(81.53,6.66) v1(82.42,58.86) v1(82.68,27.11) v1(82.8,35.11) v1(82.8,28.89) v1(82.8,20.51) v1(83.19,11.99) v1(83.31,39.68) v1(83.69,51.11) v1(83.69,49.84) v1(83.72,47.34) v1(83.69,46.03) v1(83.69,44.76) v1(84.46,53.14) v1(85.22,30.41) v1(85.98,20.5) v1(85.98,4.63) v1(86.49,25.2) v1(86.74,53.4) v1(86.87,50.47) v1(88.9,53.4) v1(88.9,4.75) v1(88.99,51.41) v1(89.03,49.59) v1(89.03,47.68) v1(89.02,45.82) v1(89.03,44.12) v1(89.03,42.47) v1(88.99,40.48) v1(89.03,38.66) v1(88.99,36.67) v1(89.03,34.6) v1(89.03,32.57) v1(88.99,30.71) v1(89.03,28.63) v1(88.99,26.39) v1(89.03,23.93) v1(89.03,21.9) v1(89.03,19.49) v1(89.03,17.07) v1(89.08,58.98)
VDDA: length 96.3
  Top Layer w0.254: U1.24 37.97,36.3 37.21,35.53 37.21,34.16 37.34,34.03 ; 37.29,12.76 36.07,12.76 35.44,12.13 U14.8 ; 25.27,52.45 TP43.1 ; 37.34,34.03 C37.1 ; 37.34,34.03 37.35,34.03 ; C11.1 37.51,44.78 41.23,44.78 41.8,44.21 U1.9 41.8,37.7 39.47,35.36 38.23,35.36 37.85,34.98 37.85,34.47 37.4,34.03 37.35,34.03 ; C21.1 37.41,12.88 38.99,12.88 39.75,13.64 39.75,21.01 37.34,23.42 37.34,31.27 37.92,31.86 37.92,33.46 37.35,34.03 ; L2.2 C17.2
  Top Layer w0.5: 12.47,34.08 12.5,34.11 v1(12.5,35.07) ; C17.2 31.56,51.93 31.05,52.45 25.28,52.45 ; 25.28,52.45 25.27,52.45 ; 25.28,52.45 v1(25.28,52.44) ; Q1.2 12.49,33.17 12.3,32.97 R29.2 ; L2.2 32.51,49.33 36.73,45.11 C11.1
  Bottom Layer w0.5: v1(25.28,52.44) 25.27,52.42 19.86,52.42 14.73,47.3 14.73,37.31 v1(12.5,35.07)
BTN_FUNCTION: length 7.4
  Top Layer w0.2: C29.2 40.51,29.77 41.4,30.66 41.4,32.57 40.8,33.17 U1.26
  Top Layer w0.254: R57.2 C29.2
BTN_TOGGLE: length 11.8
  Top Layer w0.254: U1.40 48.85,37.8 50.9,35.74 55.37,35.74 55.94,35.17 C28.2 57.54,34.85 R56.2
CUR_SENSE: length 9.9
  Top Layer w0.254: R58.1 30.85,8.31 28.7,6.15 26.16,6.15 25.02,5.01 25.02,3.27 U3.23
CUR_SENSE_ON: length 37.8
  Top Layer w0.254: R10.1 45.85,22.41 44.07,20.63 42.78,20.63 42.42,20.27 42.42,14.66 38.48,10.72 38.48,7.42 37.21,6.15 30.99,6.15 29,4.16 U3.21
DEV_GND: length 22
  Top Layer w0.254: C24.1 23.7,16.06 22.48,16.06 21.97,15.55 21.97,12.5 22.73,11.74 26.8,11.74 27.56,10.98 D12.1 27.48,8.69 25.53,8.69 23,6.16 U3.24
DEV_POS_IN: length 51.1
  Top Layer w0.254: v1(24,9.07) R37.1
  Bottom Layer w0.254: U3.1 69,5.6 67.18,7.42 66.17,7.42 63.63,9.96 48.72,9.96 47.32,8.56 24.51,8.56 v1(24,9.07)
DEV_POS_OUT: length 11
  Top Layer w0.254: 13.46,7.18 13.6,7.04 20.07,7.04 21.21,5.9 21.21,3.46 U3.25
DEV_POS_REL_IN: length 91.1
  Top Layer w0.254: 85.09,8.29 85.09,6.38 83.56,4.85 66.39,4.85 66.04,4.5 66.04,1.45 65.79,1.2 50.16,1.2 49.91,1.45 49.91,2.34 ; D19.1 86.51,8.29 R70.2 ; R4.2 9.77,7.18 10.54,6.41 19.18,6.41 19.69,5.9 19.69,1.83 20.32,1.2 47.88,1.2 48.2,1.52 48.2,2.47 48.98,3.25 U3.11 49.91,2.34
DEV_TEMP_P: length 19.7
  Top Layer w0.254: U6.1 2.29,42.43 2.29,37.88 ; 2.29,37.88 2.3,37.9 P2.1 ; 2.29,37.88 2.29,30.79 3.53,29.55 H2.1
ERROR: length 22.2
  Top Layer w0.254: P1.5 80.26,35.74 78.98,34.46 Q5.3 ; U10.1 78.98,20.69 78.98,22.39 ; 78.98,22.39 78.99,22.41 78.99,24.17 Q5.3 ; 78.98,22.39 Q5.3
FEEDBACK: length 44.1
  Top Layer w0.254: 78.98,13.9 78.98,15.2 U7.1 78.5,14.38 78.98,13.9 ; 78.98,13.9 Q2.3 78.22,10.85 ; P1.4 84.71,31.93 86.11,30.54 86.11,26.98 85.34,26.22 81.79,26.22 80.81,25.24 80.81,7.58 79.63,6.41 78.61,6.41 78.24,6.78 78.24,10.85
FEEDBACK_LED: length 9.6
  Top Layer w0.254: R53.2 31.61,35.48 32.55,36.42 32.55,37.18 33.4,38.03 36.46,38.03 37.72,39.3 U1.18
I2C2_SCL: length 44.6
  Top Layer w0.2: U1.30 42.8,34.8 42.8,36.12 42.54,36.38 v1(42.54,37.39)
  Top Layer w0.254: R75.2 57.9,53.4 64.26,47.05 v1(64.26,43.11)
  Bottom Layer w0.2: v1(42.54,37.39) 42.54,37.52 43.56,38.54 50.04,38.54 54.61,43.11 v1(64.26,43.11)
I2C2_SDA: length 45.1
  Top Layer w0.2: U1.31 43.3,36.12 v1(44.45,37.27)
  Top Layer w0.254: R74.2 51.44,52.63 52.2,51.87 57.91,51.87 62.74,47.05 62.74,42.98 v1(64.13,41.58)
  Bottom Layer w0.2: v1(44.45,37.27) 44.7,37.52 50.67,37.52 53.47,40.32 58.81,40.32 60.32,41.84 61.79,41.84
  Bottom Layer w0.254: v1(64.13,41.58) 63.88,41.84 61.79,41.84
IND_LED_BLU: length 3.7
  Top Layer w0.254: R54.2 44.07,31.52 43.81,31.78 43.81,34.78 U1.32
IND_LED_GRN: length 13
  Top Layer w0.254: U1.45 50.95,40.3 51.31,39.93 53.21,39.93 54.1,40.82 54.1,42.22 55.75,43.87 R60.1
IND_LED_RED: length 6.6
  Top Layer w0.254: R65.1 49.4,31.68 47.88,33.2 45.72,33.2 45.3,33.62 U1.35
MCU_ANA_DEV_I: length 17.7
  Top Layer w0.127: R59.1 30.88,30.81 30.88,28.77 30.7,28.6 30.7,26.89 TP20.1
  Top Layer w0.254: U1.20 37.99,38.3 37.34,37.65 37.34,37.39 35.87,35.92 34.28,35.92 C30.2 33.46,34.92 32.6,34.05 32.6,32.78 31.61,31.8 R59.1
MCU_ANA_DEV_T: length 14
  Top Layer w0.254: TP35.1 31.75,29.64 R35.1 32.38,29.77 33.4,30.79 33.4,33.27 C23.1 34.35,34.22 35.81,34.22 36.45,34.85 36.45,35.74 38,37.3 U1.22
MCU_ANA_DEV_V: length 16.5
  Top Layer w0.127: 31.62,33.97 31.37,34.22 29.53,34.22 29.2,34.55 28.14,34.55 27.43,33.84 26.54,33.84 26.29,34.09
  Top Layer w0.254: U1.19 37.87,38.8 36.6,37.52 34.04,37.52 33.46,36.95 33.46,36.44 32.55,35.53 32.55,34.77 31.61,33.83 R40.1
MCU_DIG_DEV_VS_OUT: length 9.6
  Top Layer w0.254: U1.16 37.61,40.3 37.47,40.44 34.04,40.44 33.27,39.67 33.27,38.79 32.19,37.71 31.84,37.71 31.57,37.45 31.57,36.93 R18.2
MCU_DIG_DEV_VS_REL: length 8.7
  Top Layer w0.254: R9.2 32,38.66 32.64,39.3 32.64,40.06 33.63,41.05 37.49,41.05 37.75,40.8 U1.15
MCU_ERROR: length 15
  Top Layer w0.2: R63.1 55.88,45.65 53.21,42.98 53.21,41.33 52.68,40.8 U1.46
  Top Layer w0.254: TP24.1 57.66,45.66 R63.1
MCU_FEEDBACK: length 4
  Top Layer w0.254: U1.27 41.3,33.68 TP23.1 R45.1
MCU_RELAY_SENSE_EN: length 7.3
  Top Layer w0.254: U1.36 45.8,34.39 46.35,33.84 48.9,33.84 51.15,31.58 51.15,31.15
MCU_TOGGLE: length 12.6
  Top Layer w0.254: U1.38 48.1,36.8 53.47,31.42 TP26.1 R42.2
RELAY_OFF: length 75.9
  Top Layer w0.254: v1(20.7,10.34) 20.7,20.38 25.02,24.69 25.02,42.6 26.42,44 R2.1 ; U3.10 51,3.92 50.29,4.63 43.56,4.63 42.29,5.9 v1(42.29,10.34)
  Bottom Layer w0.254: v1(42.29,10.34) v1(20.7,10.34)
RELAY_ON: length 82.2
  Top Layer w0.254: v1(19.56,12.12) 19.56,20.63 23.11,24.19 23.11,44.63 26.03,47.55 R1.1 ; v1(43.94,10.09) 43.94,6.28 44.58,5.64 51.69,5.64 53,4.33 U3.9
  Bottom Layer w0.254: v1(43.94,10.09) 41.91,12.12 v1(19.56,12.12)
RESET: length 86.2
  Top Layer w0.254: 64.26,19.33 64.26,19.66 ; 64.26,19.33 64.35,19.24 64.35,11.1 SW2.2 64.6,10.6 TP18.1 ; 64.26,19.33 64.26,11.39 64.1,11.22 ; 64.26,19.66 64.58,19.98 64.58,20.82 66.29,22.53 66.29,46.54 64.49,48.34 v1(64.49,48.4) ; 64.26,19.66 SW2.1 ; 79.53,46.28 82.45,49.2 84.5,49.2 ; D9.1 78.39,47.3 75.09,47.3 v1(74.26,48.12) ; v1(59.49,48.33) 59.44,48.38 53.61,48.38 C5.2 51.63,48.12 R14.1 R50.1
  Bottom Layer w0.254: v1(59.49,48.33) 59.53,48.38 74.01,48.38 v1(74.26,48.12)
SMBUS_ALERT: length 68.8
  Top Layer w0.254: D1.1 58.77,7.8 v1(57.02,7.8) 57.15,7.93 57.15,26.6 57.7,27.15 59.77,27.15 61.85,29.22 61.85,35.62 60.71,36.76 v1(60.07,36.76) R3.1
  Bottom Layer w0.254: U3.19 33,6.39 34.16,7.55 56.77,7.55 v1(57.02,7.8) ; v1(60.07,36.76) 60.2,36.76 60.83,36.12 63.54,36.12 TP47.1
SMBUS_CLK: length 69.1
  Top Layer w0.254: v1(64.84,6.89) 63.88,6.89 D2.1 63.88,6.28 63.5,5.9 61.34,5.9 60.83,6.41 60.83,19.74 60.71,19.87 60.71,26.6 62.87,28.76 62.87,36.76 61.09,38.54 v1(60.07,38.54) R6.1
  Bottom Layer w0.254: TP46.1 65.59,37.9 60.71,37.9 v1(60.07,38.54) ; U3.13 45,4.42 45.59,5.01 63.75,5.01 64.84,6.1 v1(64.84,6.89)
SMBUS_DATA: length 75.3
  Top Layer w0.254: D3.1 v1(62.87,6.88) 62.87,19.74 62.99,19.87 62.99,26.73 63.88,27.61 63.88,38.03 61.59,40.31 v1(60.07,40.31) R8.1
  Bottom Layer w0.254: v1(62.87,6.88) 62.51,6.53 38.1,6.53 37,5.43 U3.17 ; 60.07,40.44 v1(60.07,40.31) 60.83,39.55 67.64,39.55 67.81,39.73 67.81,39.85
STACK_ENABLED: length 15.9
  Top Layer w0.254: SW1.3 46.33,7.96 45.21,9.07 45.21,10.47 44.32,11.36 41.78,11.36 40.51,10.09 40.51,3.74 U3.15
STL_COM_RX: length 9.9
  Top Layer w0.254: R26.1 31.68,45.84 32.96,45.84 35.25,43.55 40.3,43.55 U1.12
STL_COM_TX: length 7.4
  Top Layer w0.254: U1.13 38.14,41.8 37.72,42.22 R28.1
SWCLK: length 14
  Top Layer w0.254: R23.1 52.71,29.65 52.2,30.16 52.2,31.68 47.58,36.3 U1.37
SWDIO: length 5.7
  Top Layer w0.254: R22.1 47.62,31.93 46.99,32.57 45.47,32.57 44.8,33.23 U1.34
TEMP_SENSE_ON: length 7.4
  Top Layer w0.254: U1.14 37.97,41.3 37.67,41.6 33.16,41.6 32,40.44
TOGGLE: length 24
  Top Layer w0.254: P1.3 82.37,28.12 80.14,25.9 80.14,8.71 R43.1
TRACESWO: length 12.1
  Top Layer w0.254: R27.1 57.54,33.33 53.97,33.33 52.58,34.73 51.04,34.73 48.48,37.3 U1.39
$1N19200: length 46.7
  Top Layer w0.254: 71.24,8.94 71.24,8.95 69.98,10.22 67.94,10.22 65.91,12.25 65.91,21.27 67.06,22.41 v1(67.06,31.42) ; 71.24,8.94 R36.1 71.19,8.38 C26.2 ; 71.24,8.94 71.88,9.58 75.31,9.58 75.82,9.07 75.82,8.47 D14.1 ; D13.1 D14.1 ; D14.1 77.22,8.44 77.48,8.18 R43.2 ; v1(60.07,31.42) R42.1
  Bottom Layer w0.254: v1(60.07,31.42) 60.32,31.68 66.8,31.68 v1(67.06,31.42)
$1N22381: length 11.9
  Top Layer w0.254: 73.4,15.7 74.08,15.01 74.98,15.01 76.07,13.92 77.47,13.92 78.1,13.29 78.1,12.17 77.7,11.76 77.34,11.76 76.98,11.4 76.98,10.69 ; U7.2 73.35,15.72 U8.2
$1N22471: length 51.5
  Top Layer w0.254: D15.1 75.2,10.87 R46.1 ; D15.1 76.92,12.5 Q2.1 ; D15.1 75.2,12.87 74.93,13.14 72.52,13.14 71.12,14.53 68.83,14.53 67.44,15.93 67.44,21.59 v1(67.38,21.65) ; v1(42.93,21.65) 42.93,26.09 42.29,26.73 R45.2
  Bottom Layer w0.254: v1(67.38,21.65) v1(42.93,21.65)
$1N22963: length 8.2
  Top Layer w0.254: Q5.2 76.98,22.55 74.62,20.19 73.38,20.19 73.38,20.2 70.49,20.2
$1N22974: length 39.7
  Top Layer w0.254: R63.2 v1(60.45,45.65) ; v1(71.5,45.65) 71.5,27.11 72.14,26.47 74.68,26.47 75.05,26.1 R64.1 ; R64.1 75.06,25.07 75.06,23.44 D18.1 ; R64.1 76.92,25.08 Q5.1
  Bottom Layer w0.254: v1(71.5,45.65) v1(60.45,45.65)
$1N25868: length 25.8
  Top Layer w0.254: R47.2 61.34,56.45 61.34,57.59 61.85,58.09 84.38,58.09 LED1.3
$1N25869: length 20.9
  Top Layer w0.254: LED1.4 85.14,57.46 67.18,57.46 66.67,56.94 R48.2
$1N25870: length 16.3
  Top Layer w0.254: 87.14,58.66 87.14,58.24 85.34,56.44 R49.2
$1N25880: length 22.4
  Top Layer w0.254: CN4.4 16.51,25.58 19.81,28.89 v1(19.81,35.08) ; v1(29.18,35.11) R53.1
  Bottom Layer w0.254: v1(29.18,35.11) 29.15,35.08 v1(19.81,35.08)
$1N27325: length 56.5
  Top Layer w0.254: v1(47.75,26.98) 47.75,29.53 R22.2 ; TP48.1 75.56,38.83 75.56,38.03 76.2,37.39 ; 76.2,37.39 78.23,37.39 79.4,38.57 D5.1 80.26,40.19 84.2,44.12 CN3.4 ; 76.2,37.39 75.44,36.63 v1(75.44,27.11)
  Bottom Layer w0.254: v1(47.75,26.98) 49.78,24.95 69.47,24.95 71.63,27.11 v1(75.44,27.11)
$1N27369: length 39
  Top Layer w0.254: 75,41.2 75.03,41.24 TP49.1 ; 75,41.2 74.55,41.2 74.17,40.82 v1(74.17,30.41) ; 75,41.2 77.72,41.2 78.74,42.22 D6.1 79.88,42.22 83.06,45.39 CN3.6 ; v1(59.94,30.28) 59.81,30.28 R23.2
  Bottom Layer w0.254: v1(74.17,30.41) 74.04,30.28 v1(59.94,30.28)
$1N27429: length 66.5
  Top Layer w0.254: v1(30.86,46.54) R26.2 30.08,45.75 30.05,45.78 v1(28.96,45.78) ; 74.7,50.35 71.75,50.35 71.5,50.09 v1(71.5,47.3) ; 74.7,50.35 75.31,50.35 77.09,52.13 79.4,52.13 ; 74.7,50.35 74.68,50.38 74.68,51.36 ; 79.4,52.13 D4.1 ; 79.4,52.13 84.84,52.13 85.78,51.19 85.78,50.47 ; v1(41.02,47.05) 42.04,48.06 45.21,48.06 46.23,49.08 v1(49.66,49.08)
  Bottom Layer w0.254: v1(41.02,47.05) 40.51,46.54 v1(30.86,46.54) ; v1(49.66,49.08) 51.44,47.3 v1(71.5,47.3)
$1N27482: length 66.2
  Top Layer w0.254: R28.2 v1(29.21,42.22) ; v1(41.28,48.44) 41.53,48.7 44.83,48.7 45.85,49.71 50.32,49.71 v1(50.96,49.08) ; CN3.14 81.53,50.47 79.4,48.35 D8.1 v1(78.13,48.32) 78.13,48.89 77.85,49.17 TP51.1
  Bottom Layer w0.254: v1(78.13,48.32) 77.37,49.08 v1(50.96,49.08) ; v1(41.28,48.44) 41.78,47.94 41.78,46.67 37.34,42.22 v1(29.21,42.22)
$1N27502: length 37.6
  Top Layer w0.254: v1(59.94,33.2) R27.2 ; TP50.1 75.02,43.38 75,43.36 ; CN3.8 82.3,46.67 79.88,44.25 D7.1 78.74,44.25 77.85,43.36 75,43.36 ; 75,43.36 73.54,43.36 72.77,42.59 v1(72.77,33.2)
  Bottom Layer w0.254: v1(72.77,33.2) v1(59.94,33.2)
$1N28372: length 2.3
  Top Layer w0.254: TP14.1 38.77,29.62 R7.1
